# Altium schematic sheet Yamper.SchDoc: Yamper: Optical Ring Encoder Board
size A4; Author: Allen Zhang and Jennifer Chen; CompanyName: Waterloop; DrawnBy: Allen Zhang and Jennifer Chen; Revision: 01; SheetNumber: 1; SheetTotal: 1
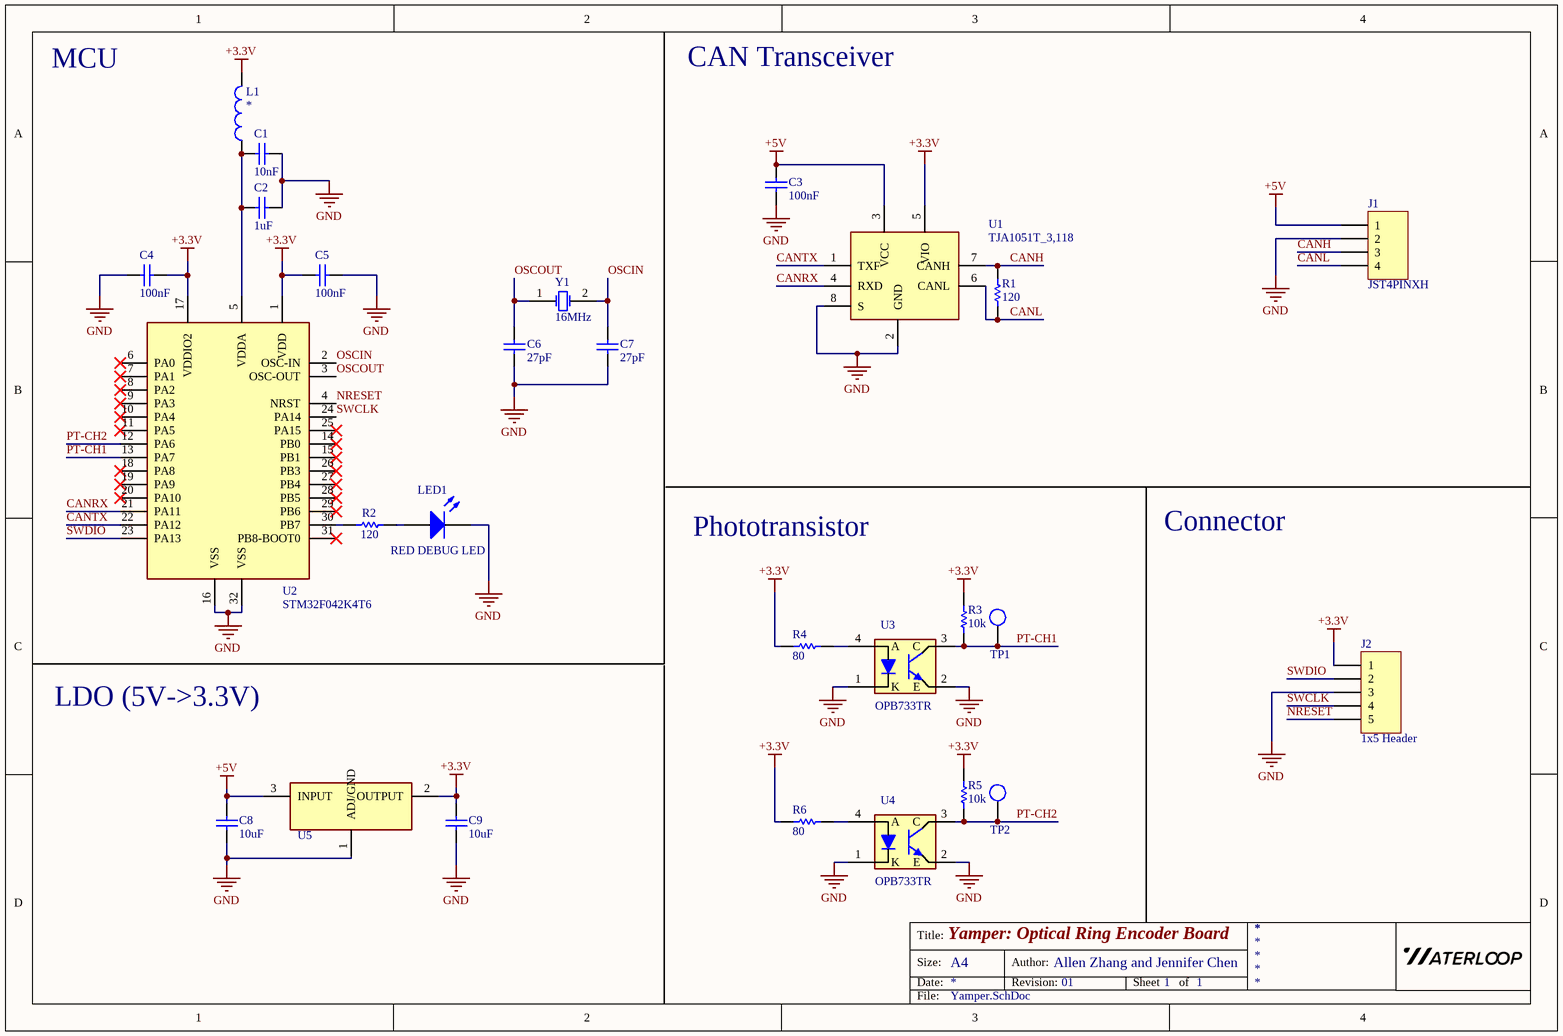
[diagram p0: Yamper.SchDoc]

## Parts
C1  value 10nF  [0805 - Capacitor]  (hidden comment: Capacitor - Nonpolarized)
C2  value 1uF  [0805 - Capacitor]  (hidden comment: Capacitor - Nonpolarized)
C3  value 100nF  [0805 - Capacitor]  (hidden comment: Capacitor - Nonpolarized)
C4  value 100nF  [0805 - Capacitor]  (hidden comment: Capacitor - Nonpolarized)
C5  value 100nF  [0805 - Capacitor]  (hidden comment: Capacitor - Nonpolarized)
C6  value 27pF  [0805 - Capacitor]  (hidden comment: Capacitor - Nonpolarized)
C7  value 27pF  [0805 - Capacitor]  (hidden comment: Capacitor - Nonpolarized)
C8  value 10uF  [0805 - Capacitor]  (hidden comment: Capacitor - Nonpolarized)
C9  value 10uF  [0805 - Capacitor]  (hidden comment: Capacitor - Nonpolarized)
J1  JST4PINXH  [B4B-XH]  (no BOM)
J2  1x5 Header  [HDR1X5]  (no BOM)
L1  Inductor  [0805 - Capacitor]  (value not drawn)
LED1  RED DEBUG LED  [0805 - Resistor]
R1  value 120  [0603 - Resistor]  (hidden comment: Resistor)
R2  value 120  [0603 - Resistor]  (hidden comment: Resistor)
R3  value 10k  [0603 - Resistor]  (hidden comment: Resistor)
R4  value 80  [0603 - Resistor]  (hidden comment: Resistor)
R5  value 10k  [0603 - Resistor]  (hidden comment: Resistor)
R6  value 80  [0603 - Resistor]  (hidden comment: Resistor)
TP1  Test Point  [Test Point]  (value not drawn)  (no BOM)
TP2  Test Point  [Test Point]  (value not drawn)  (no BOM)
U1  TJA1051T_3,118  [TJA1051T/3,118]  (no BOM)
U2  STM32F042K4T6  [QFP80P900X900X160-32N]  (no BOM)
U3  OPB733TR  [OPB733TR]  (no BOM)
U4  OPB733TR  [OPB733TR]  (no BOM)
U5  TLV1117-33IDCYR  [TLV1117]  (value not drawn)  (no BOM)
Y1  value 16MHz  [2-SMD NO LEAD CRSYSTAL]  (hidden comment: Oscillator)

## Nets
+3.3V: C4.1 C5.2 C9.2 J2.1 L1.2 R3.2 R4.1 R5.2 R6.1 U1.5(VIO) U2.1(VDD) U2.17(VDDIO2) U5.2(OUTPUT)
+5V: C3.2 C8.1 J1.1 U1.3(VCC) U5.3(INPUT)
GND: C1.2 C2.2 C3.1 C4.2 C5.1 C6.1 C7.1 C8.2 C9.1 J1.2 J2.3 LED1.2(K) U1.2(GND) U1.8(S) U2.16(VSS) U2.32(VSS) U3.1(K) U3.2(E) U4.1(K) U4.2(E) U5.1(ADJ/GND)
CANH: J1.3 R1.2 U1.7(CANH)
CANL: J1.4 R1.1 U1.6(CANL)
CANRX: U1.4(RXD) U2.21(PA11)
CANTX: U1.1(TXF) U2.22(PA12)
NRESET: J2.5 U2.4(NRST)
OSCIN: C7.2 U2.2(OSC-IN) Y1.2(OSC2)
OSCOUT: C6.2 U2.3(OSC-OUT) Y1.1(OSC1)
PT-CH1: R3.1 TP1.1 U2.13(PA7) U3.3(C)
PT-CH2: R5.1 TP2.1 U2.12(PA6) U4.3(C)
SWCLK: J2.4 U2.24(PA14)
SWDIO: J2.2 U2.23(PA13)
NetC1_1: C1.1 C2.1 L1.1 U2.5(VDDA)
NetLED1_1: LED1.1(A) R2.2
NetR2_1: R2.1 U2.30(PB7)
NetR4_2: R4.2 U3.4(A)
NetR6_2: R6.2 U4.4(A)

Not connected (* = marked no-connect by the designer): U2 6(PA0)* 7(PA1)* 8(PA2)* 9(PA3)* 10(PA4)* 11(PA5)* 14(PB0)* 15(PB1)* 18(PA8)* 19(PA9)* 20(PA10)* 25(PA15)* 26(PB3)* 27(PB4)* 28(PB5)* 29(PB6)* 31(PB8-BOOT0)*

## Notes on the sheet
- MCU
- CAN Transceiver
- Phototransistor
- Connector
- LDO (5V->3.3V)
- Title:
- Size:
- Date:
- A4
- Author:
- Revision:
- Sheet
- of
- File:

## Library data of the parts
C1-C9 = Capacitor - Nonpolarized: Nonpolarized Capacitor; Supplier Part Number: *; Supplier: *; Manufacturer: *; Rating: *; Manufacturer Part Number: *
J1 = 1x4 Header: 1x4 Pin Header
J2 = 1x5 Header: 1x5 Pin Header
LED1 = LED: Light Emitting Diode; Value: *; Manufacturer Part Number: *; Manufacturer: *; Supplier Part Number: *; Rating: *; Supplier: *
U1 = TJA1051T_3,118: CAN Transceiver IC 4.5V-5.5V 250ns; Manufacturer: NXP; Datasheet: http://www.nxp.com/docs/en/data-sheet/TJA1051.pdf; Manufacturer Part Number: TJA1051T/3,118; Supplier Part Number: 568-8684-1-ND; Supplier: Digikey; ComponentLink1Description: Datasheet; ComponentLink1URL: http://www.nxp.com/docs/en/data-sheet/TJA1051.pdf
U2 = STM32F042K4T6: Microcontroller; Manufacturer_Name: STMicroelectronics; Height: 1.6mm; Manufacturer_Part_Number: STM32F042K4T6; Mouser Part Number: 511-STM32F042K4T6; Mouser Price/Stock: https://www.mouser.co.uk/ProductDetail/STMicroelectronics/STM32F042K4T6?qs=ClYTdQWm4hDAfZj5dd9NhA%3D%3D; ComponentLink1Description: Datasheet; ComponentLink1URL: https://www.mouser.com/datasheet/2/389/stm32f042c4-956225.pdf
U3 U4 = OPB733TR: Phototransistor
U5 = TLV1117-33IDCYR: Linear Voltage Regulator IC 3.3V 800MA SOT223-4; Manufacturer: Texas Instruments; Manufacturer Part Number: TLV1117-33IDCYR; Supplier Part Number: 296-21112-1-ND; Supplier: Digikey; ComponentLink1Description: Datasheet; ComponentLink1URL: http://www.ti.com/lit/ds/symlink/tlv1117.pdf?HQS=TI-null-null-digikeymode-df-pf-null-wwe&ts=1590668900314
Y1 = Oscillator: Crystal Oscillator; Manufacturer Part Number: *; Manufacturer: *; Supplier Part Number: *; Supplier: *; Rating: *
L1 = Inductor: Rating: *; Manufacturer Part Number: *; Supplier Part Number: *; Supplier: *; Manufacturer: *; Value: *
R1-R6 = Resistor: Rating: *; Manufacturer Part Number: *; Manufacturer: *; Supplier Part Number: *; Supplier: *